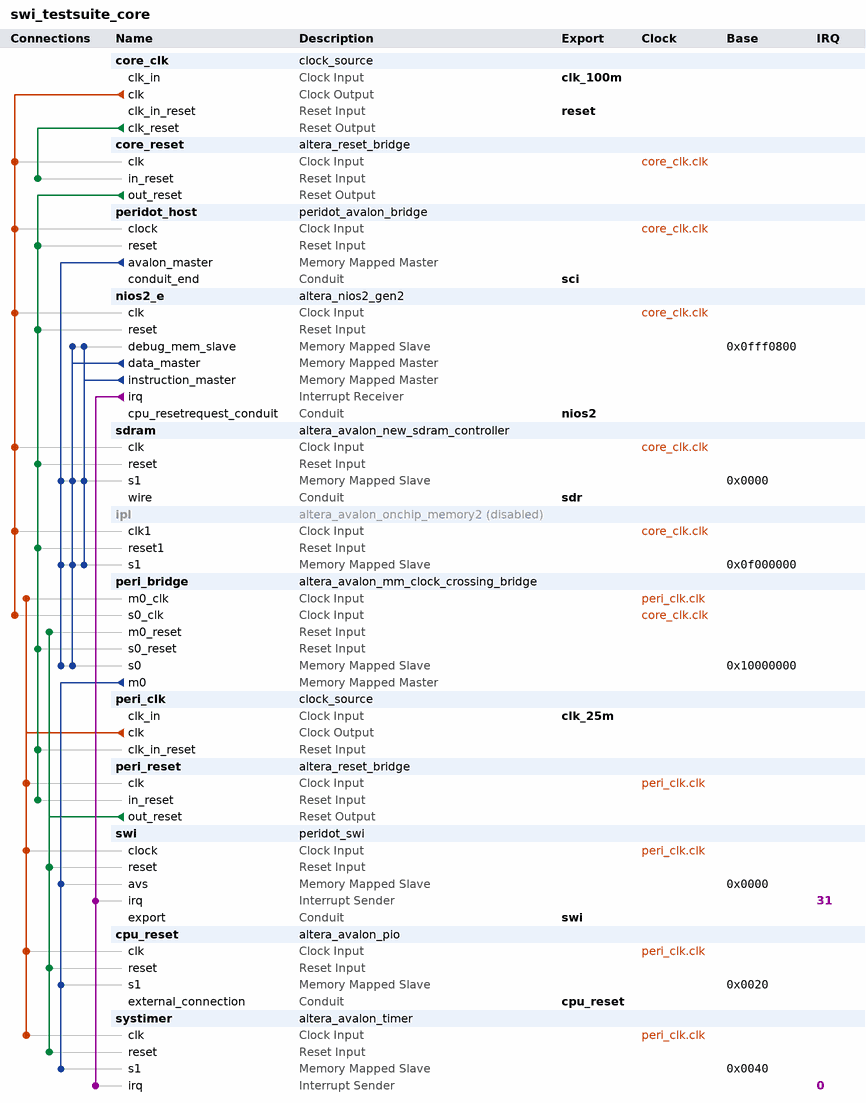
[diagram p0: system contents]
# Platform Designer (Qsys) system swi_testsuite_core, Cyclone IV E EP4CE6E22C8
# Parameters at their usual value, and those the tool derives, are not listed.
package require -exact qsys 16.1
create_system swi_testsuite_core
set_project_property DEVICE_FAMILY {Cyclone IV E}
set_project_property DEVICE EP4CE6E22C8

add_instance core_clk clock_source 16.1
set_instance_parameter_value core_clk clockFrequency 100000000

add_instance core_reset altera_reset_bridge 16.1
set_instance_parameter_value core_reset ACTIVE_LOW_RESET 0
set_instance_parameter_value core_reset SYNCHRONOUS_EDGES deassert

add_instance peridot_host peridot_avalon_bridge 0.9

add_instance nios2_e altera_nios2_gen2 16.1
set_instance_parameter_value nios2_e cpuReset true
set_instance_parameter_value nios2_e dcache_size 0
set_instance_parameter_value nios2_e exceptionSlave sdram.s1
set_instance_parameter_value nios2_e icache_numTCIM 1
set_instance_parameter_value nios2_e icache_size 16384
set_instance_parameter_value nios2_e impl Tiny
set_instance_parameter_value nios2_e mul_64_impl 1
set_instance_parameter_value nios2_e resetSlave sdram.s1
set_instance_parameter_value nios2_e setting_branchpredictiontype Static
set_instance_parameter_value nios2_e shift_rot_impl 0

add_instance sdram altera_avalon_new_sdram_controller 16.1
set_instance_parameter_value sdram TAC 5.4
set_instance_parameter_value sdram TRCD 21.0
set_instance_parameter_value sdram TRFC 63.0
set_instance_parameter_value sdram TRP 21.0
set_instance_parameter_value sdram casLatency 3
set_instance_parameter_value sdram columnWidth 8
set_instance_parameter_value sdram dataWidth 16
set_instance_parameter_value sdram generateSimulationModel false
set_instance_parameter_value sdram model single_Micron_MT48LC4M32B2_7_chip
set_instance_parameter_value sdram numberOfBanks 4
set_instance_parameter_value sdram numberOfChipSelects 1
set_instance_parameter_value sdram powerUpDelay 200.0
set_instance_parameter_value sdram refreshPeriod 15.625
set_instance_parameter_value sdram rowWidth 12

add_instance ipl altera_avalon_onchip_memory2 16.1
set_instance_property ipl ENABLED false
set_instance_parameter_value ipl dataWidth 32
set_instance_parameter_value ipl dualPort false
set_instance_parameter_value ipl initMemContent true
set_instance_parameter_value ipl initializationFileName onchip_mem.hex
set_instance_parameter_value ipl memorySize 4096
set_instance_parameter_value ipl resetrequest_enabled false

add_instance peri_bridge altera_avalon_mm_clock_crossing_bridge 16.1
set_instance_parameter_value peri_bridge ADDRESS_WIDTH 10
set_instance_parameter_value peri_bridge COMMAND_FIFO_DEPTH 4
set_instance_parameter_value peri_bridge DATA_WIDTH 32
set_instance_parameter_value peri_bridge MASTER_SYNC_DEPTH 2
set_instance_parameter_value peri_bridge MAX_BURST_SIZE 1
set_instance_parameter_value peri_bridge RESPONSE_FIFO_DEPTH 4
set_instance_parameter_value peri_bridge SLAVE_SYNC_DEPTH 2
set_instance_parameter_value peri_bridge USE_AUTO_ADDRESS_WIDTH 1

add_instance peri_clk clock_source 16.1
set_instance_parameter_value peri_clk clockFrequency 25000000

add_instance peri_reset altera_reset_bridge 16.1
set_instance_parameter_value peri_reset ACTIVE_LOW_RESET 0
set_instance_parameter_value peri_reset SYNCHRONOUS_EDGES deassert

add_instance swi peridot_swi 1.1
set_instance_parameter_value swi CLASSID 1923125249
set_instance_parameter_value swi CLOCKFREQ 25000000
set_instance_parameter_value swi PART_NAME EP4CE6E22C8
set_instance_parameter_value swi TIMECODE 0

add_instance cpu_reset altera_avalon_pio 16.1
set_instance_parameter_value cpu_reset direction Output
set_instance_parameter_value cpu_reset resetValue 1
set_instance_parameter_value cpu_reset width 1

add_instance systimer altera_avalon_timer 16.1
set_instance_parameter_value systimer period 1
set_instance_parameter_value systimer periodUnits MSEC

# connections
add_connection core_clk.clk core_reset.clk clock
add_connection core_clk.clk ipl.clk1 clock
add_connection core_clk.clk nios2_e.clk clock
add_connection core_clk.clk peri_bridge.s0_clk clock
add_connection core_clk.clk peridot_host.clock clock
add_connection core_clk.clk sdram.clk clock
add_connection peri_clk.clk cpu_reset.clk clock
add_connection peri_clk.clk peri_bridge.m0_clk clock
add_connection peri_clk.clk peri_reset.clk clock
add_connection peri_clk.clk swi.clock clock
add_connection peri_clk.clk systimer.clk clock
add_connection core_clk.clk_reset core_reset.in_reset reset
add_connection core_reset.out_reset ipl.reset1 reset
add_connection core_reset.out_reset nios2_e.reset reset
add_connection core_reset.out_reset peri_bridge.s0_reset reset
add_connection core_reset.out_reset peri_clk.clk_in_reset reset
add_connection core_reset.out_reset peri_reset.in_reset reset
add_connection core_reset.out_reset peridot_host.reset reset
add_connection core_reset.out_reset sdram.reset reset
add_connection peri_reset.out_reset cpu_reset.reset reset
add_connection peri_reset.out_reset peri_bridge.m0_reset reset
add_connection peri_reset.out_reset swi.reset reset
add_connection peri_reset.out_reset systimer.reset reset
add_connection nios2_e.data_master ipl.s1 avalon
set_connection_parameter_value nios2_e.data_master/ipl.s1 baseAddress 0x0f000000
add_connection nios2_e.data_master nios2_e.debug_mem_slave avalon
set_connection_parameter_value nios2_e.data_master/nios2_e.debug_mem_slave baseAddress 0x0fff0800
add_connection nios2_e.data_master peri_bridge.s0 avalon
set_connection_parameter_value nios2_e.data_master/peri_bridge.s0 baseAddress 0x10000000
add_connection nios2_e.data_master sdram.s1 avalon
set_connection_parameter_value nios2_e.data_master/sdram.s1 baseAddress 0x0000
add_connection nios2_e.instruction_master ipl.s1 avalon
set_connection_parameter_value nios2_e.instruction_master/ipl.s1 baseAddress 0x0f000000
add_connection nios2_e.instruction_master nios2_e.debug_mem_slave avalon
set_connection_parameter_value nios2_e.instruction_master/nios2_e.debug_mem_slave baseAddress 0x0fff0800
add_connection nios2_e.instruction_master sdram.s1 avalon
set_connection_parameter_value nios2_e.instruction_master/sdram.s1 baseAddress 0x0000
add_connection peri_bridge.m0 cpu_reset.s1 avalon
set_connection_parameter_value peri_bridge.m0/cpu_reset.s1 baseAddress 0x0020
add_connection peri_bridge.m0 swi.avs avalon
set_connection_parameter_value peri_bridge.m0/swi.avs baseAddress 0x0000
add_connection peri_bridge.m0 systimer.s1 avalon
set_connection_parameter_value peri_bridge.m0/systimer.s1 baseAddress 0x0040
add_connection peridot_host.avalon_master ipl.s1 avalon
set_connection_parameter_value peridot_host.avalon_master/ipl.s1 baseAddress 0x0f000000
add_connection peridot_host.avalon_master peri_bridge.s0 avalon
set_connection_parameter_value peridot_host.avalon_master/peri_bridge.s0 baseAddress 0x10000000
add_connection peridot_host.avalon_master sdram.s1 avalon
set_connection_parameter_value peridot_host.avalon_master/sdram.s1 baseAddress 0x0000
add_connection nios2_e.irq swi.irq interrupt
set_connection_parameter_value nios2_e.irq/swi.irq irqNumber 31
add_connection nios2_e.irq systimer.irq interrupt
set_connection_parameter_value nios2_e.irq/systimer.irq irqNumber 0

# exported interfaces
add_interface clk_100m clock sink
set_interface_property clk_100m EXPORT_OF core_clk.clk_in
add_interface clk_25m clock sink
set_interface_property clk_25m EXPORT_OF peri_clk.clk_in
add_interface cpu_reset conduit end
set_interface_property cpu_reset EXPORT_OF cpu_reset.external_connection
add_interface nios2 conduit end
set_interface_property nios2 EXPORT_OF nios2_e.cpu_resetrequest_conduit
add_interface reset reset sink
set_interface_property reset EXPORT_OF core_clk.clk_in_reset
add_interface sci conduit end
set_interface_property sci EXPORT_OF peridot_host.conduit_end
add_interface sdr conduit end
set_interface_property sdr EXPORT_OF sdram.wire
add_interface swi conduit end
set_interface_property swi EXPORT_OF swi.export

set_interconnect_requirement {$system} qsys_mm.clockCrossingAdapter HANDSHAKE
set_interconnect_requirement {$system} qsys_mm.enableEccProtection FALSE
set_interconnect_requirement {$system} qsys_mm.insertDefaultSlave FALSE
set_interconnect_requirement {$system} qsys_mm.maxAdditionalLatency 1

save_system swi_testsuite_core.qsys
